# EAGLE design led_table_final_mass_done (EAGLE 7.6.0)
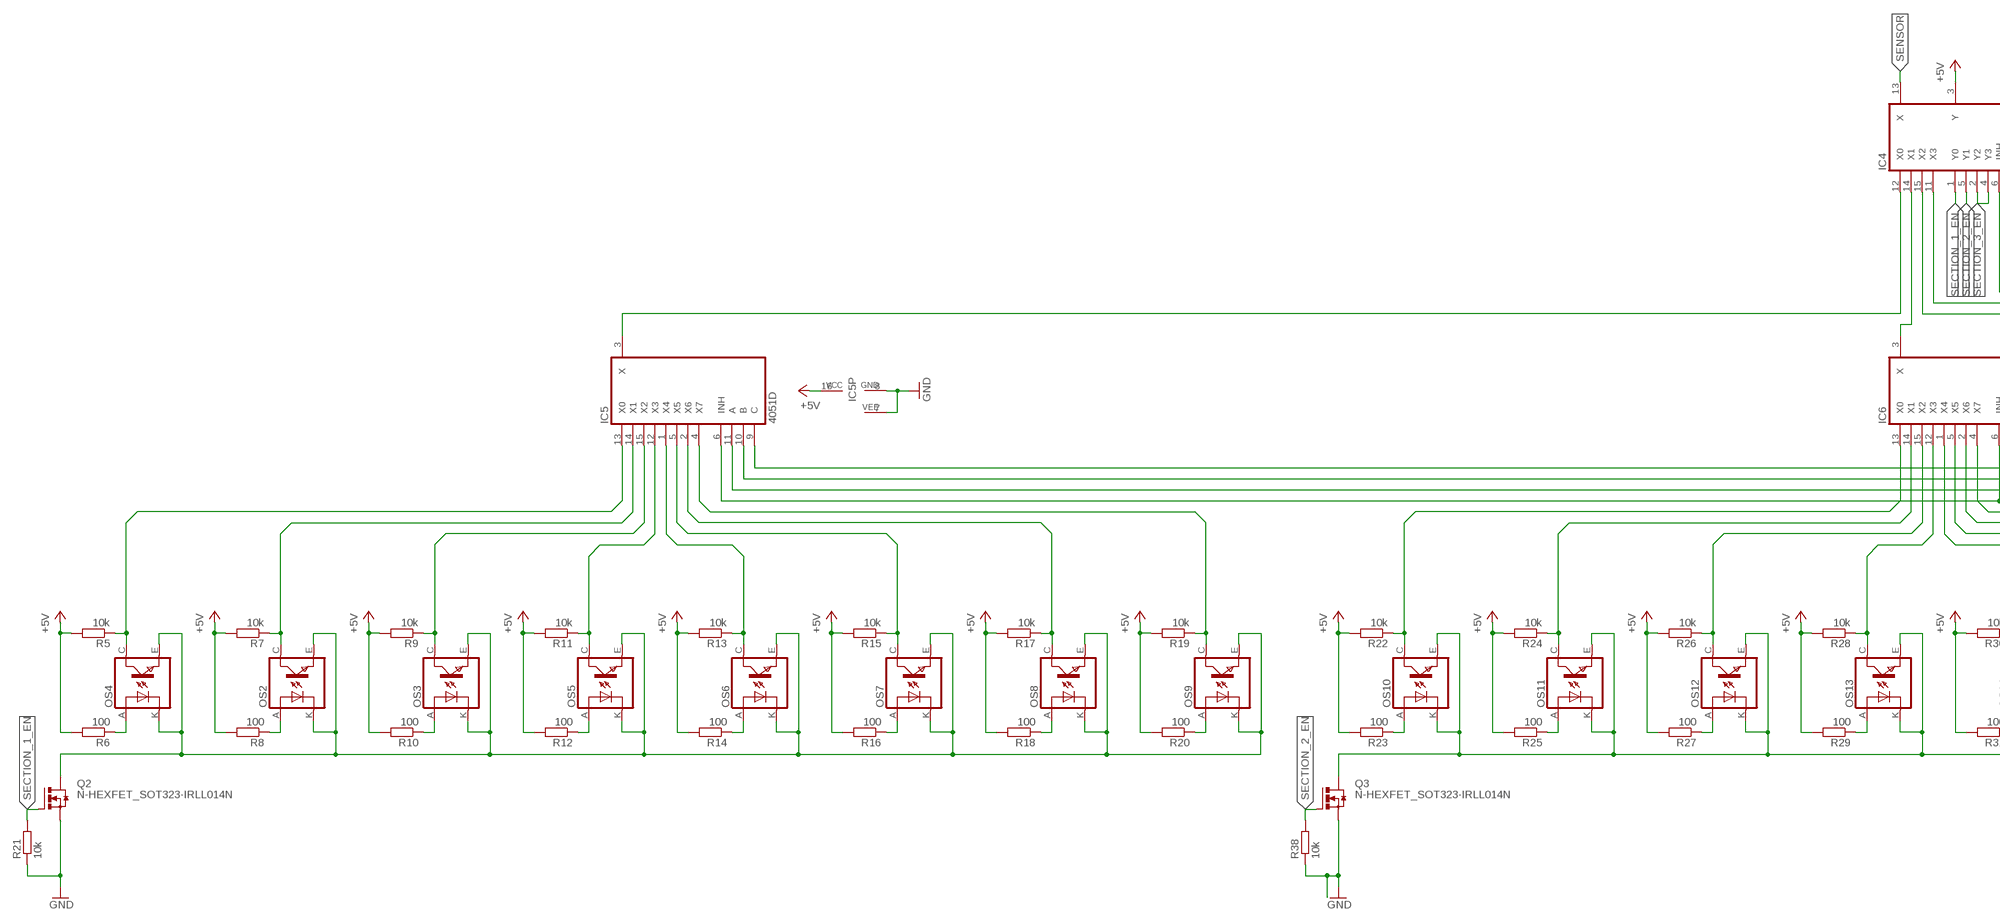
[diagram p0: schematic, sheet 1, part 1 of 2]
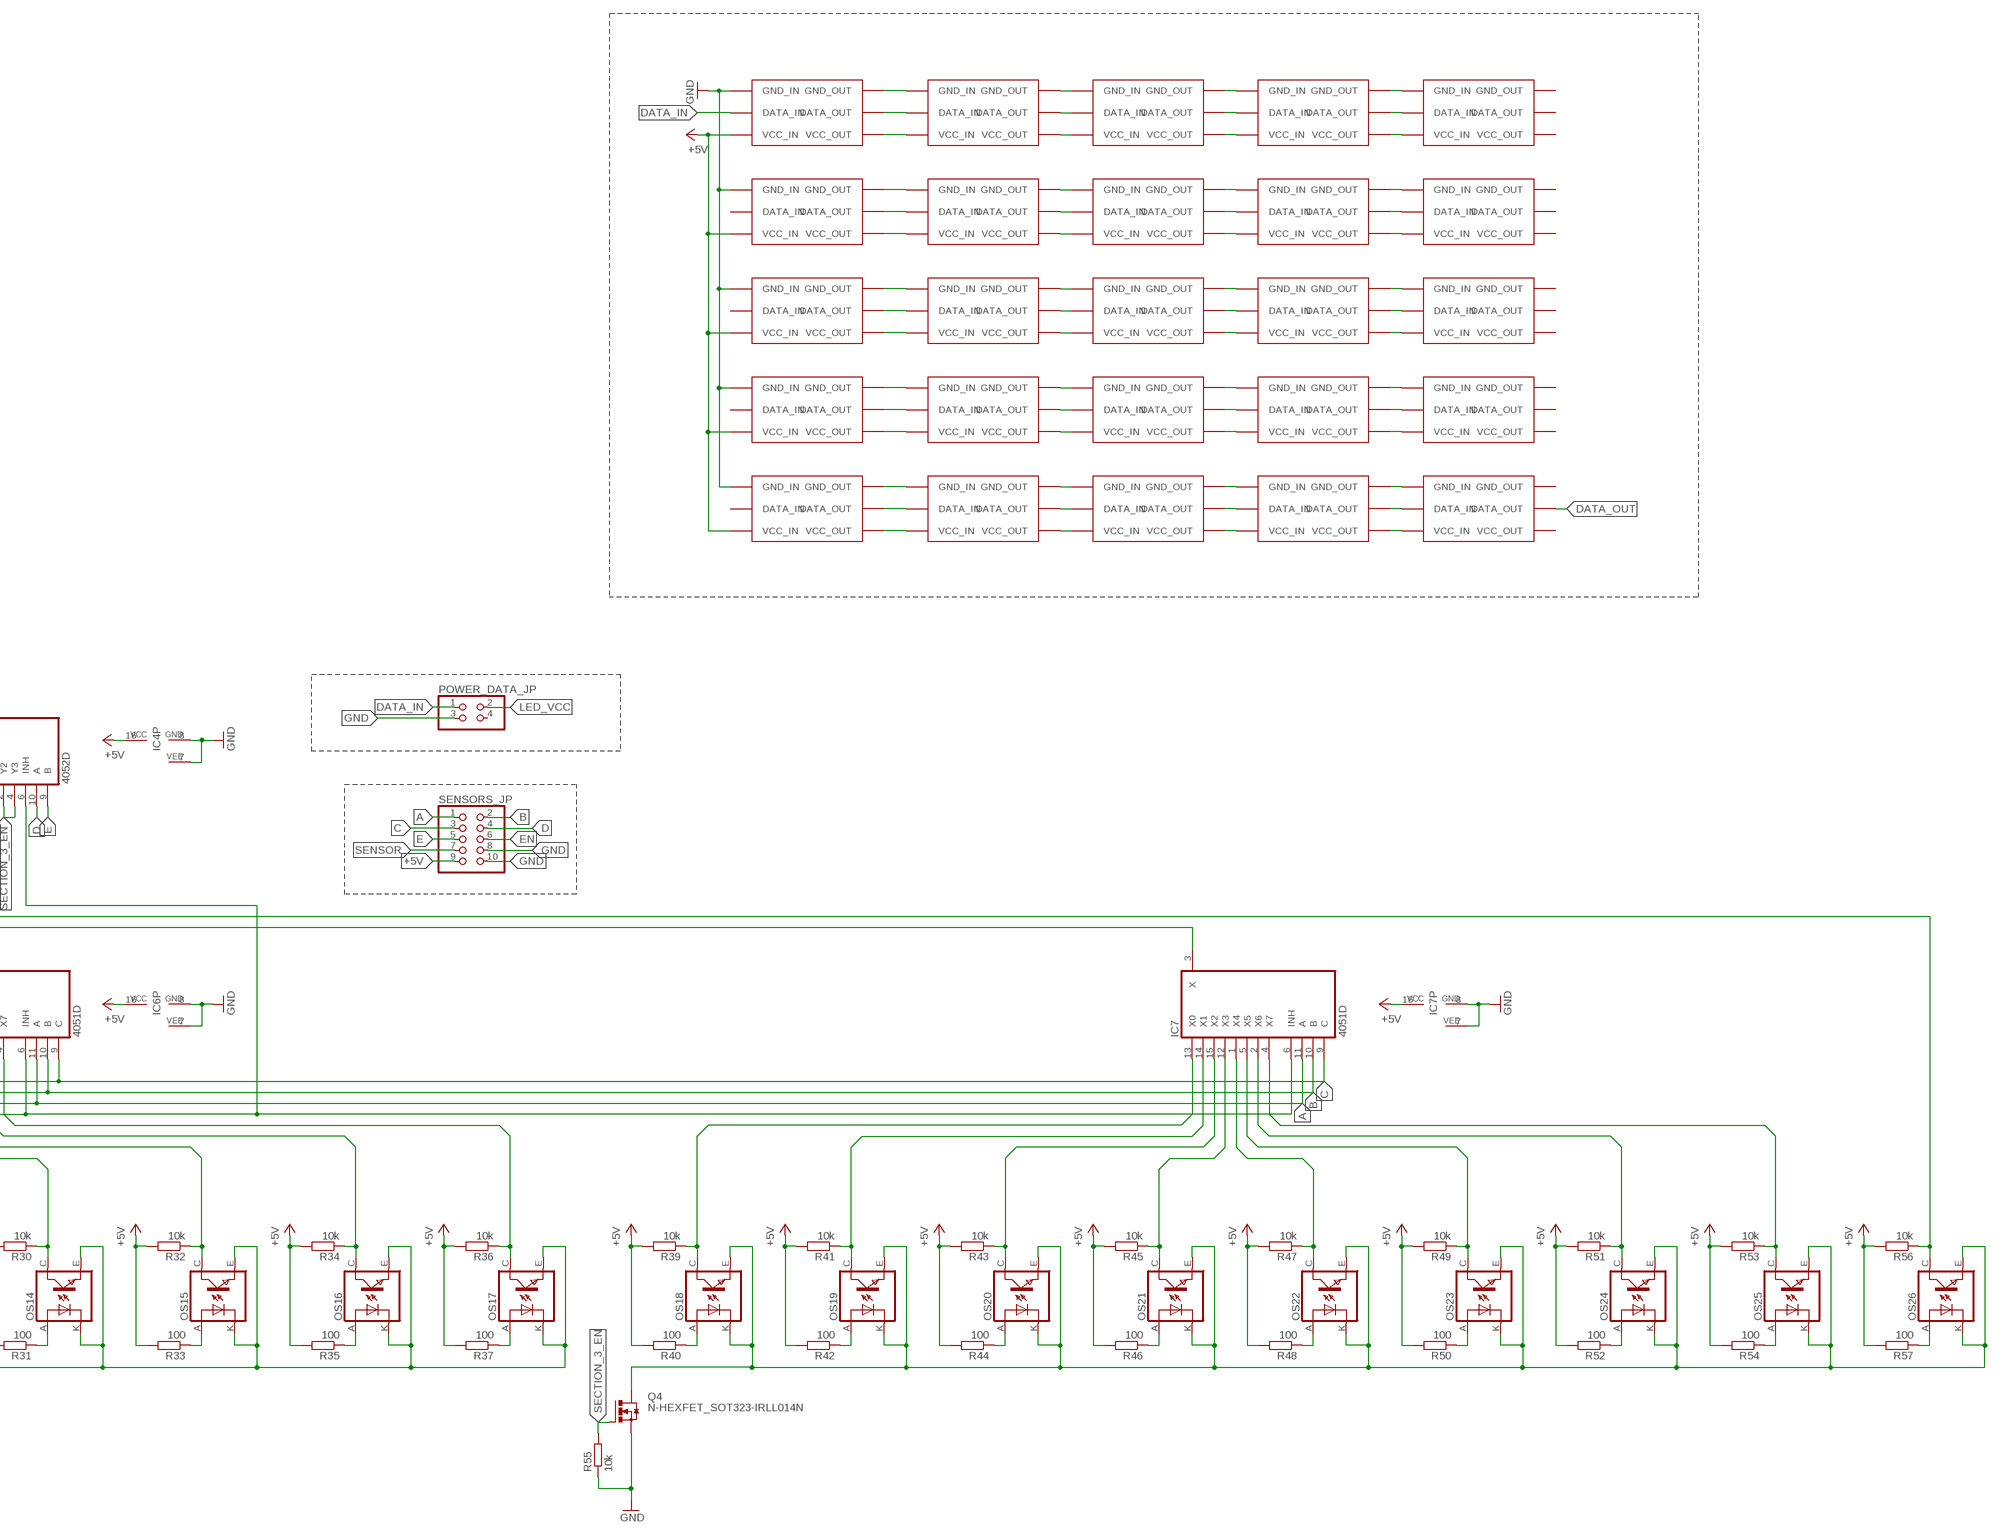
[diagram p1: schematic, sheet 1, part 2 of 2]

## Parts
IC4  4052D  [SO16]
IC5  4051D  [SO16]
IC6  4051D  [SO16]
IC7  4051D  [SO16]
OS2  TCRT5000  [TCRT5000]
OS3  TCRT5000  [TCRT5000]
OS4  TCRT5000  [TCRT5000]
OS5  TCRT5000  [TCRT5000]
OS6  TCRT5000  [TCRT5000]
OS7  TCRT5000  [TCRT5000]
OS8  TCRT5000  [TCRT5000]
OS9  TCRT5000  [TCRT5000]
OS10  TCRT5000  [TCRT5000]
OS11  TCRT5000  [TCRT5000]
OS12  TCRT5000  [TCRT5000]
OS13  TCRT5000  [TCRT5000]
OS14  TCRT5000  [TCRT5000]
OS15  TCRT5000  [TCRT5000]
OS16  TCRT5000  [TCRT5000]
OS17  TCRT5000  [TCRT5000]
OS18  TCRT5000  [TCRT5000]
OS19  TCRT5000  [TCRT5000]
OS20  TCRT5000  [TCRT5000]
OS21  TCRT5000  [TCRT5000]
OS22  TCRT5000  [TCRT5000]
OS23  TCRT5000  [TCRT5000]
OS24  TCRT5000  [TCRT5000]
OS25  TCRT5000  [TCRT5000]
OS26  TCRT5000  [TCRT5000]
POWER_DATA_JP  PINHD-2X2  [2X02]
Q2  N-HEXFET_SOT323-IRLL014N  [SOT223]
Q3  N-HEXFET_SOT323-IRLL014N  [SOT223]
Q4  N-HEXFET_SOT323-IRLL014N  [SOT223]
R5  10k  R-EU_R1206  [R1206]
R6  100  R-EU_R1206  [R1206]
R7  10k  R-EU_R1206  [R1206]
R8  100  R-EU_R1206  [R1206]
R9  10k  R-EU_R1206  [R1206]
R10  100  R-EU_R1206  [R1206]
R11  10k  R-EU_R1206  [R1206]
R12  100  R-EU_R1206  [R1206]
R13  10k  R-EU_R1206  [R1206]
R14  100  R-EU_R1206  [R1206]
R15  10k  R-EU_R1206  [R1206]
R16  100  R-EU_R1206  [R1206]
R17  10k  R-EU_R1206  [R1206]
R18  100  R-EU_R1206  [R1206]
R19  10k  R-EU_R1206  [R1206]
R20  100  R-EU_R1206  [R1206]
R21  10k  R-EU_R1206  [R1206]
R22  10k  R-EU_R1206  [R1206]
R23  100  R-EU_R1206  [R1206]
R24  10k  R-EU_R1206  [R1206]
R25  100  R-EU_R1206  [R1206]
R26  10k  R-EU_R1206  [R1206]
R27  100  R-EU_R1206  [R1206]
R28  10k  R-EU_R1206  [R1206]
R29  100  R-EU_R1206  [R1206]
R30  10k  R-EU_R1206  [R1206]
R31  100  R-EU_R1206  [R1206]
R32  10k  R-EU_R1206  [R1206]
R33  100  R-EU_R1206  [R1206]
R34  10k  R-EU_R1206  [R1206]
R35  100  R-EU_R1206  [R1206]
R36  10k  R-EU_R1206  [R1206]
R37  100  R-EU_R1206  [R1206]
R38  10k  R-EU_R1206  [R1206]
R39  10k  R-EU_R1206  [R1206]
R40  100  R-EU_R1206  [R1206]
R41  10k  R-EU_R1206  [R1206]
R42  100  R-EU_R1206  [R1206]
R43  10k  R-EU_R1206  [R1206]
R44  100  R-EU_R1206  [R1206]
R45  10k  R-EU_R1206  [R1206]
R46  100  R-EU_R1206  [R1206]
R47  10k  R-EU_R1206  [R1206]
R48  100  R-EU_R1206  [R1206]
R49  10k  R-EU_R1206  [R1206]
R50  100  R-EU_R1206  [R1206]
R51  10k  R-EU_R1206  [R1206]
R52  100  R-EU_R1206  [R1206]
R53  10k  R-EU_R1206  [R1206]
R54  100  R-EU_R1206  [R1206]
R55  10k  R-EU_R1206  [R1206]
R56  10k  R-EU_R1206  [R1206]
R57  100  R-EU_R1206  [R1206]
SENSORS_JP  PINHD-2X5  [2X05]
U$1  WS2812_ON_STRIP  [WS_PIN]
U$2  WS2812_ON_STRIP  [WS_PIN]
U$3  WS2812_ON_STRIP  [WS_PIN]
U$4  WS2812_ON_STRIP  [WS_PIN]
U$5  WS2812_ON_STRIP  [WS_PIN]
U$6  WS2812_ON_STRIP  [WS_PIN]
U$7  WS2812_ON_STRIP  [WS_PIN]
U$8  WS2812_ON_STRIP  [WS_PIN]
U$9  WS2812_ON_STRIP  [WS_PIN]
U$10  WS2812_ON_STRIP  [WS_PIN]
U$11  WS2812_ON_STRIP  [WS_PIN]
U$12  WS2812_ON_STRIP  [WS_PIN]
U$13  WS2812_ON_STRIP  [WS_PIN]
U$14  WS2812_ON_STRIP  [WS_PIN]
U$15  WS2812_ON_STRIP  [WS_PIN]
U$16  WS2812_ON_STRIP  [WS_PIN]
U$17  WS2812_ON_STRIP  [WS_PIN]
U$18  WS2812_ON_STRIP  [WS_PIN]
U$19  WS2812_ON_STRIP  [WS_PIN]
U$20  WS2812_ON_STRIP  [WS_PIN]
U$21  WS2812_ON_STRIP  [WS_PIN]
U$22  WS2812_ON_STRIP  [WS_PIN]
U$23  WS2812_ON_STRIP  [WS_PIN]
U$24  WS2812_ON_STRIP  [WS_PIN]
U$25  WS2812_ON_STRIP  [WS_PIN]

## Nets
+5V: IC4.3(Y) IC4.16(VCC) IC5.16(VCC) IC6.16(VCC) IC7.16(VCC) R5.2 R6.2 R7.2 R8.2 R9.2 R10.2 R11.2 R12.2 R13.2 R14.2 R15.2 R16.2 R17.2 R18.2 R19.2 R20.2 R22.2 R23.2 R24.2 R25.2 R26.2 R27.2 R28.2 R29.2 R30.2 R31.2 R32.2 R33.2 R34.2 R35.2 R36.2 R37.2 R39.2 R40.2 R41.2 R42.2 R43.2 R44.2 R45.2 R46.2 R47.2 R48.2 R49.2 R50.2 R51.2 R52.2 R53.2 R54.2 R56.2 R57.2 SENSORS_JP.9
A: IC5.11(A) IC6.11(A) IC7.11(A) SENSORS_JP.1
B: IC5.10(B) IC6.10(B) IC7.10(B) SENSORS_JP.2
C: IC5.9(C) IC6.9(C) IC7.9(C) SENSORS_JP.3
D: IC4.10(A) SENSORS_JP.4
DATA_IN: POWER_DATA_JP.1 U$16.DATA_IN
DATA_OUT: U$10.DATA_OUT
E: IC4.9(B) SENSORS_JP.5
EN: IC4.6(INH) IC5.6(INH) IC6.6(INH) IC7.6(INH) SENSORS_JP.6
GND: IC4.7(VEE) IC4.8(GND) IC5.7(VEE) IC5.8(GND) IC6.7(VEE) IC6.8(GND) IC7.7(VEE) IC7.8(GND) POWER_DATA_JP.3 Q2.3(S) Q3.3(S) Q4.3(S) R21.1 R38.1 R55.1 SENSORS_JP.8 SENSORS_JP.10 U$1.GND_IN U$6.GND_IN U$11.GND_IN U$16.GND_IN U$21.GND_IN
LED_VCC: POWER_DATA_JP.2 U$1.VCC_IN U$6.VCC_IN U$11.VCC_IN U$16.VCC_IN U$21.VCC_IN ; supply symbol labelled +5V
N$1: U$1.VCC_OUT U$2.VCC_IN
N$2: U$1.DATA_OUT U$2.DATA_IN
N$3: U$1.GND_OUT U$2.GND_IN
N$4: U$2.VCC_OUT U$3.VCC_IN
N$5: U$2.DATA_OUT U$3.DATA_IN
N$6: U$2.GND_OUT U$3.GND_IN
N$7: U$3.VCC_OUT U$4.VCC_IN
N$8: U$3.DATA_OUT U$4.DATA_IN
N$9: U$3.GND_OUT U$4.GND_IN
N$10: U$4.VCC_OUT U$5.VCC_IN
N$11: OS4.A(ANODE) R6.1
N$12: IC5.13(X0) OS4.C(COLLECTOR) R5.1
N$13: IC5.14(X1) OS2.C(COLLECTOR) R7.1
N$14: IC5.15(X2) OS3.C(COLLECTOR) R9.1
N$15: OS2.A(ANODE) R8.1
N$16: IC5.1(X4) OS6.C(COLLECTOR) R13.1
N$17: IC6.13(X0) OS10.C(COLLECTOR) R22.1
N$18: OS3.A(ANODE) R10.1
N$19: OS10.A(ANODE) R23.1
N$20: IC5.12(X3) OS5.C(COLLECTOR) R11.1
N$21: OS5.A(ANODE) R12.1
N$22: IC6.14(X1) OS11.C(COLLECTOR) R24.1
N$23: OS11.A(ANODE) R25.1
N$24: OS6.A(ANODE) R14.1
N$25: OS12.A(ANODE) R27.1
N$26: IC5.5(X5) OS7.C(COLLECTOR) R15.1
N$27: OS7.A(ANODE) R16.1
N$28: IC6.12(X3) OS13.C(COLLECTOR) R28.1
N$29: IC5.2(X6) OS8.C(COLLECTOR) R17.1
N$30: OS8.A(ANODE) R18.1
N$31: OS2.E(EMITTER) OS2.K(CATHODE) OS3.E(EMITTER) OS3.K(CATHODE) OS4.E(EMITTER) OS4.K(CATHODE) OS5.E(EMITTER) OS5.K(CATHODE) OS6.E(EMITTER) OS6.K(CATHODE) OS7.E(EMITTER) OS7.K(CATHODE) OS8.E(EMITTER) OS8.K(CATHODE) OS9.E(EMITTER) OS9.K(CATHODE) Q2.4(D)
N$32: IC5.4(X7) OS9.C(COLLECTOR) R19.1
N$33: OS9.A(ANODE) R20.1
N$34: OS13.A(ANODE) R29.1
N$35: U$4.DATA_OUT U$5.DATA_IN
N$36: OS14.A(ANODE) R31.1
N$37: IC6.5(X5) OS15.C(COLLECTOR) R32.1
N$38: OS15.A(ANODE) R33.1
N$39: IC6.2(X6) OS16.C(COLLECTOR) R34.1
N$40: OS16.A(ANODE) R35.1
N$41: OS10.E(EMITTER) OS10.K(CATHODE) OS11.E(EMITTER) OS11.K(CATHODE) OS12.E(EMITTER) OS12.K(CATHODE) OS13.E(EMITTER) OS13.K(CATHODE) OS14.E(EMITTER) OS14.K(CATHODE) OS15.E(EMITTER) OS15.K(CATHODE) OS16.E(EMITTER) OS16.K(CATHODE) OS17.E(EMITTER) OS17.K(CATHODE) Q3.4(D)
N$42: IC6.4(X7) OS17.C(COLLECTOR) R36.1
N$43: OS17.A(ANODE) R37.1
N$44: U$4.GND_OUT U$5.GND_IN
N$45: IC6.15(X2) OS12.C(COLLECTOR) R26.1
N$46: IC6.1(X4) OS14.C(COLLECTOR) R30.1
N$47: IC7.13(X0) OS18.C(COLLECTOR) R39.1
N$48: OS18.A(ANODE) R40.1
N$49: IC7.14(X1) OS19.C(COLLECTOR) R41.1
N$50: OS19.A(ANODE) R42.1
N$51: OS20.A(ANODE) R44.1
N$52: IC7.12(X3) OS21.C(COLLECTOR) R45.1
N$53: OS21.A(ANODE) R46.1
N$54: OS22.A(ANODE) R48.1
N$55: IC7.5(X5) OS23.C(COLLECTOR) R49.1
N$56: OS23.A(ANODE) R50.1
N$57: IC7.2(X6) OS24.C(COLLECTOR) R51.1
N$58: OS24.A(ANODE) R52.1
N$59: U$6.VCC_OUT U$7.VCC_IN
N$60: IC7.4(X7) OS25.C(COLLECTOR) R53.1
N$61: OS25.A(ANODE) R54.1
N$62: U$6.DATA_OUT U$7.DATA_IN
N$63: IC7.15(X2) OS20.C(COLLECTOR) R43.1
N$64: IC7.1(X4) OS22.C(COLLECTOR) R47.1
N$65: U$6.GND_OUT U$7.GND_IN
N$66: U$7.VCC_OUT U$8.VCC_IN
N$67: U$7.DATA_OUT U$8.DATA_IN
N$68: U$7.GND_OUT U$8.GND_IN
N$69: IC4.12(X0) IC5.3(X)
N$70: IC4.14(X1) IC6.3(X)
N$71: IC4.15(X2) IC7.3(X)
N$72: IC4.11(X3) OS26.C(COLLECTOR) R56.1
N$73: OS18.E(EMITTER) OS18.K(CATHODE) OS19.E(EMITTER) OS19.K(CATHODE) OS20.E(EMITTER) OS20.K(CATHODE) OS21.E(EMITTER) OS21.K(CATHODE) OS22.E(EMITTER) OS22.K(CATHODE) OS23.E(EMITTER) OS23.K(CATHODE) OS24.E(EMITTER) OS24.K(CATHODE) OS25.E(EMITTER) OS25.K(CATHODE) OS26.E(EMITTER) OS26.K(CATHODE) Q4.4(D)
N$74: U$8.VCC_OUT U$9.VCC_IN
N$75: OS26.A(ANODE) R57.1
N$76: U$8.DATA_OUT U$9.DATA_IN
N$77: U$8.GND_OUT U$9.GND_IN
N$78: U$9.VCC_OUT U$10.VCC_IN
N$79: U$9.DATA_OUT U$10.DATA_IN
N$80: U$9.GND_OUT U$10.GND_IN
N$81: U$11.VCC_OUT U$12.VCC_IN
N$82: U$11.DATA_OUT U$12.DATA_IN
N$83: U$11.GND_OUT U$12.GND_IN
N$84: U$12.VCC_OUT U$13.VCC_IN
N$85: U$12.DATA_OUT U$13.DATA_IN
N$86: U$12.GND_OUT U$13.GND_IN
N$87: U$13.VCC_OUT U$14.VCC_IN
N$88: U$13.DATA_OUT U$14.DATA_IN
N$89: U$13.GND_OUT U$14.GND_IN
N$90: U$14.VCC_OUT U$15.VCC_IN
N$91: U$14.DATA_OUT U$15.DATA_IN
N$92: U$14.GND_OUT U$15.GND_IN
N$93: U$16.VCC_OUT U$17.VCC_IN
N$94: U$16.DATA_OUT U$17.DATA_IN
N$95: U$16.GND_OUT U$17.GND_IN
N$96: U$17.VCC_OUT U$18.VCC_IN
N$97: U$17.DATA_OUT U$18.DATA_IN
N$98: U$17.GND_OUT U$18.GND_IN
N$99: U$18.VCC_OUT U$19.VCC_IN
N$100: U$18.DATA_OUT U$19.DATA_IN
N$101: U$18.GND_OUT U$19.GND_IN
N$102: U$19.VCC_OUT U$20.VCC_IN
N$103: U$19.DATA_OUT U$20.DATA_IN
N$104: U$19.GND_OUT U$20.GND_IN
N$105: U$21.VCC_OUT U$22.VCC_IN
N$106: U$21.DATA_OUT U$22.DATA_IN
N$107: U$21.GND_OUT U$22.GND_IN
N$108: U$22.VCC_OUT U$23.VCC_IN
N$109: U$22.DATA_OUT U$23.DATA_IN
N$110: U$22.GND_OUT U$23.GND_IN
N$111: U$23.VCC_OUT U$24.VCC_IN
N$112: U$23.DATA_OUT U$24.DATA_IN
N$113: U$23.GND_OUT U$24.GND_IN
N$114: U$24.VCC_OUT U$25.VCC_IN
N$115: U$24.DATA_OUT U$25.DATA_IN
N$116: U$24.GND_OUT U$25.GND_IN
SECTION_1_EN: IC4.1(Y0) Q2.1(G) R21.2
SECTION_2_EN: IC4.5(Y1) Q3.1(G) R38.2
SECTION_3_EN: IC4.2(Y2) IC4.4(Y3) Q4.1(G) R55.2
SENSOR: IC4.13(X) SENSORS_JP.7
Unconnected: POWER_DATA_JP.4 U$1.DATA_IN U$5.DATA_OUT U$6.DATA_IN U$11.DATA_IN U$15.DATA_OUT U$20.DATA_OUT U$21.DATA_IN U$25.DATA_OUT

## Power pins joined to a net without a drawn wire
GND_OUT: U$5.GND_OUT U$10.GND_OUT U$15.GND_OUT U$20.GND_OUT U$25.GND_OUT
VCC_OUT: U$5.VCC_OUT U$10.VCC_OUT U$15.VCC_OUT U$20.VCC_OUT U$25.VCC_OUT

## Library data of the parts
IC4 = 40xx:4052: Dual 4-channel ANALOG MULTIPLEXER
IC5-IC7 = 40xx:4051: 8-channel ANALOG MULTIPLEXER
OS2-OS26 = tcrt5000:TCRT5000
POWER_DATA_JP = pinhead:PINHD-2X2: PIN HEADER
Q2-Q4 = transistor-power:N-HEXFET_?-*: HEXFET® Power MOSFET
R5-R57 = rcl:R-EU_: RESISTOR, European symbol
SENSORS_JP = pinhead:PINHD-2X5: PIN HEADER
U$1-U$25 = ws2812_on_strip:WS2812_ON_STRIP

## Board
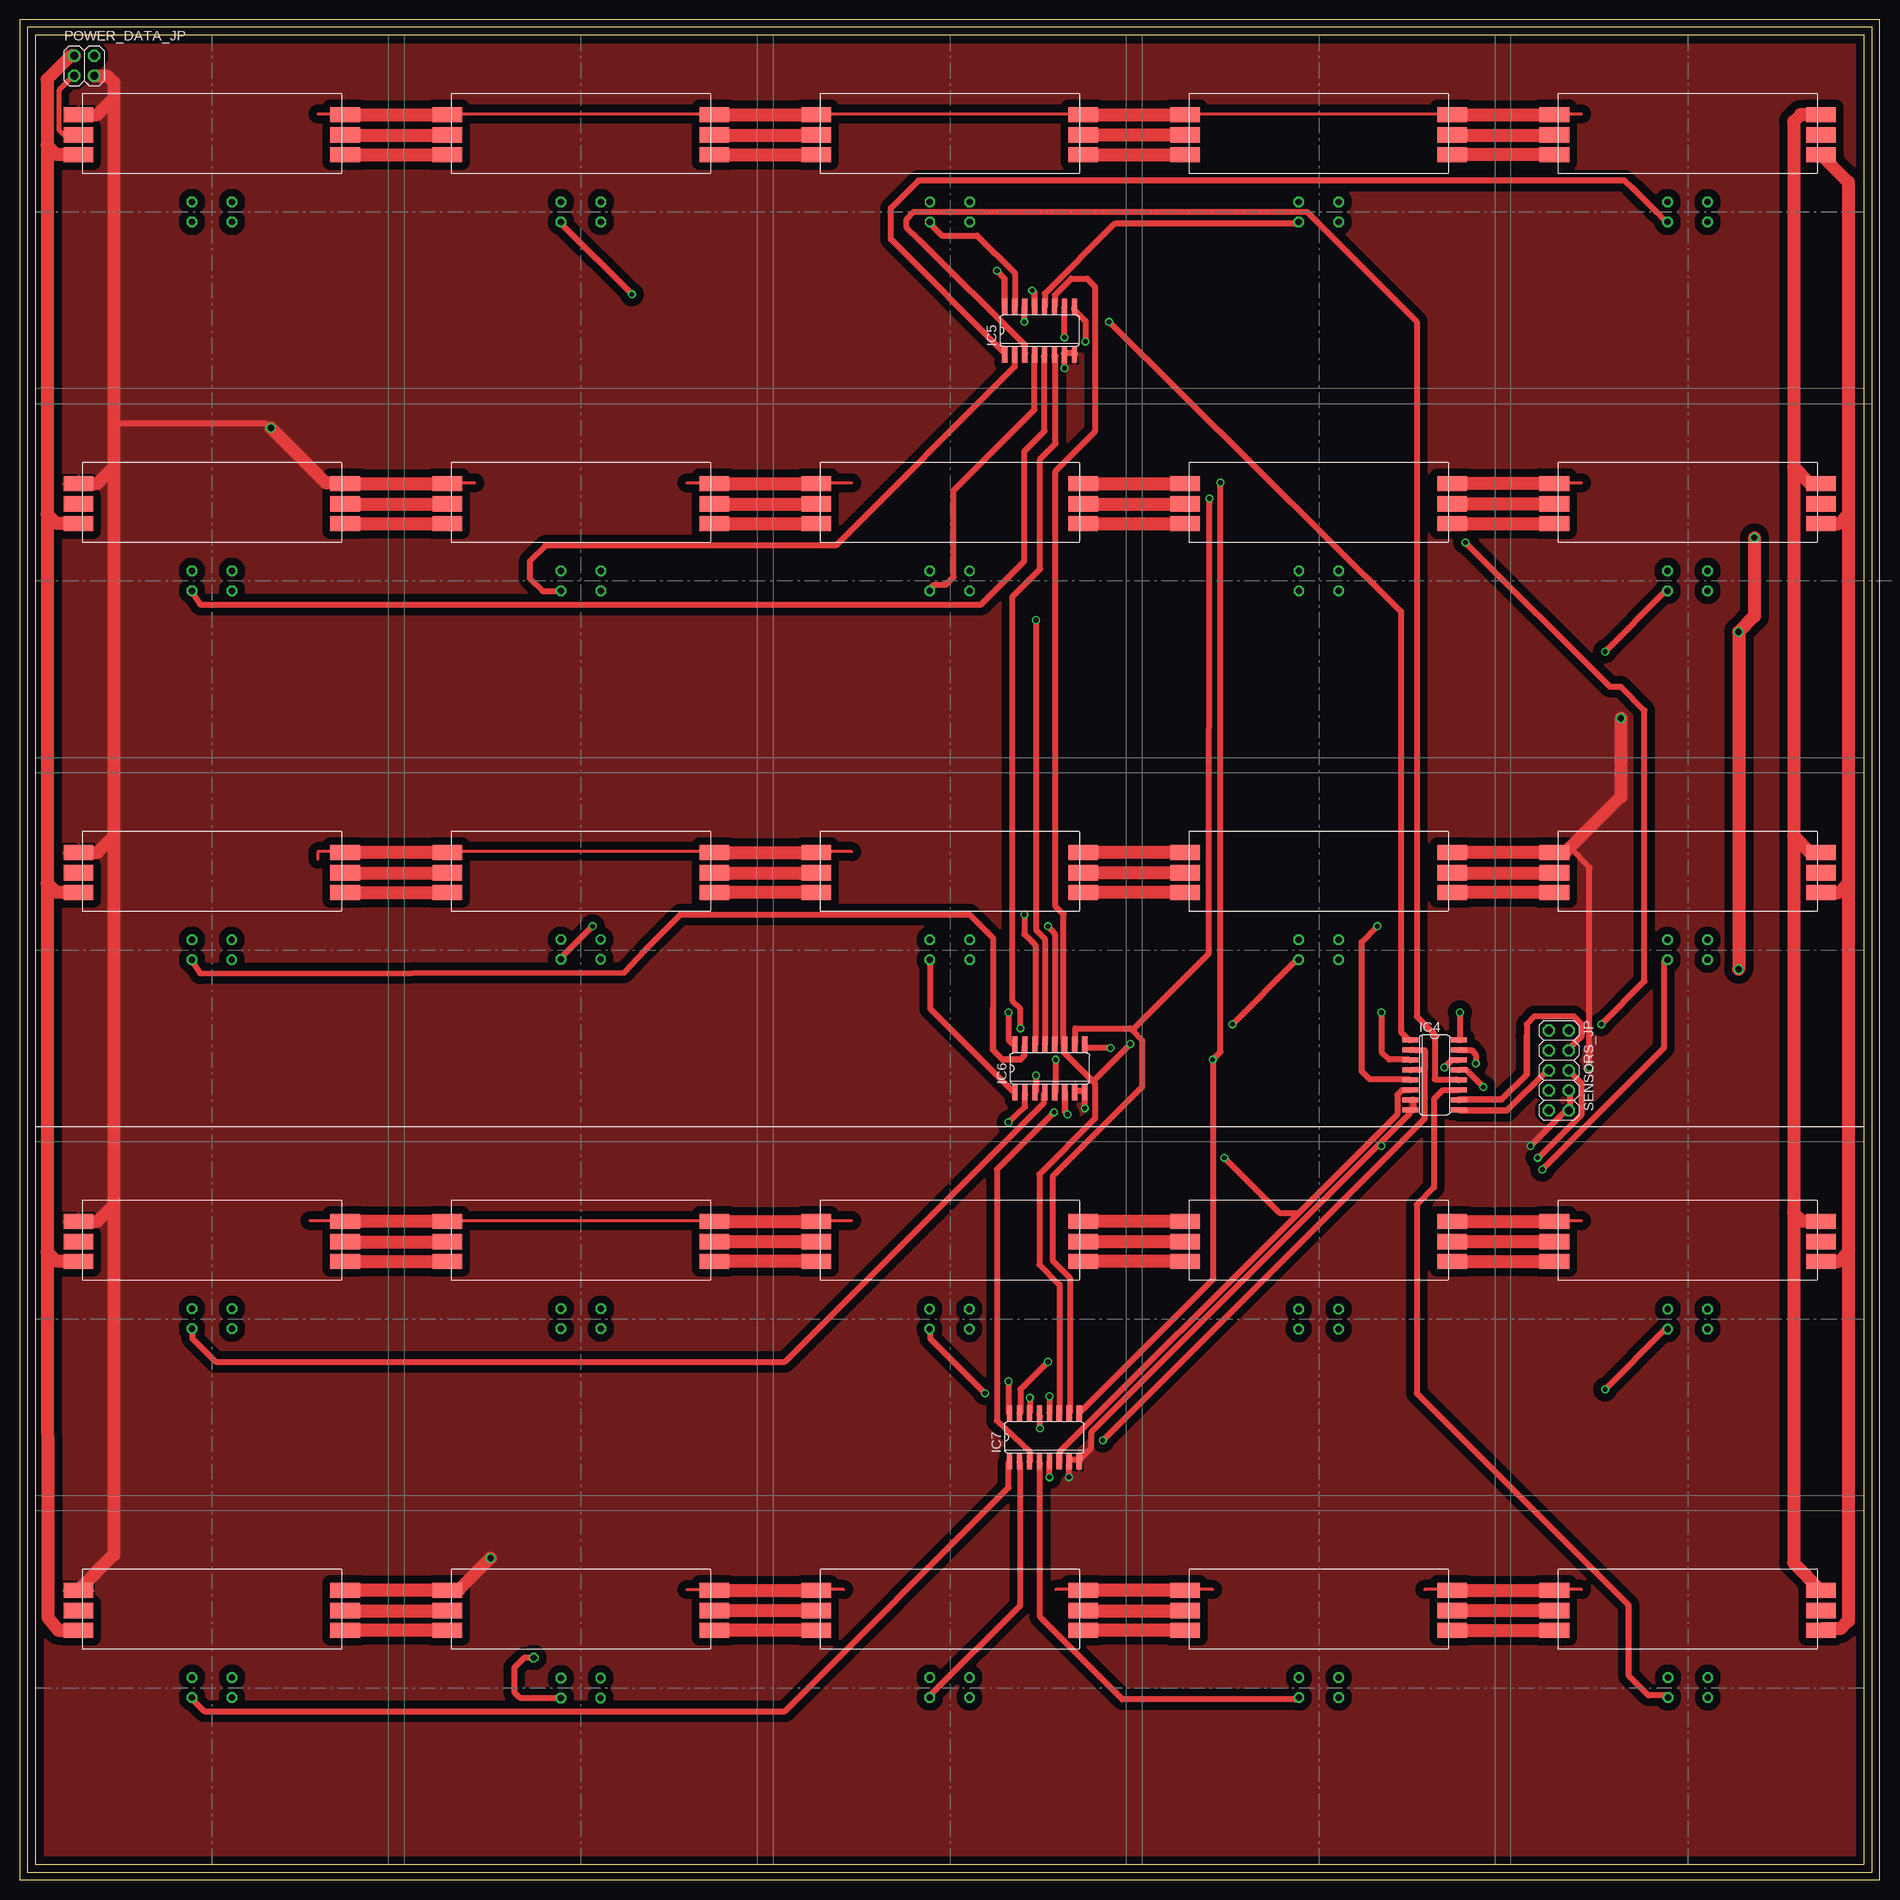
[diagram p2: board, top side]
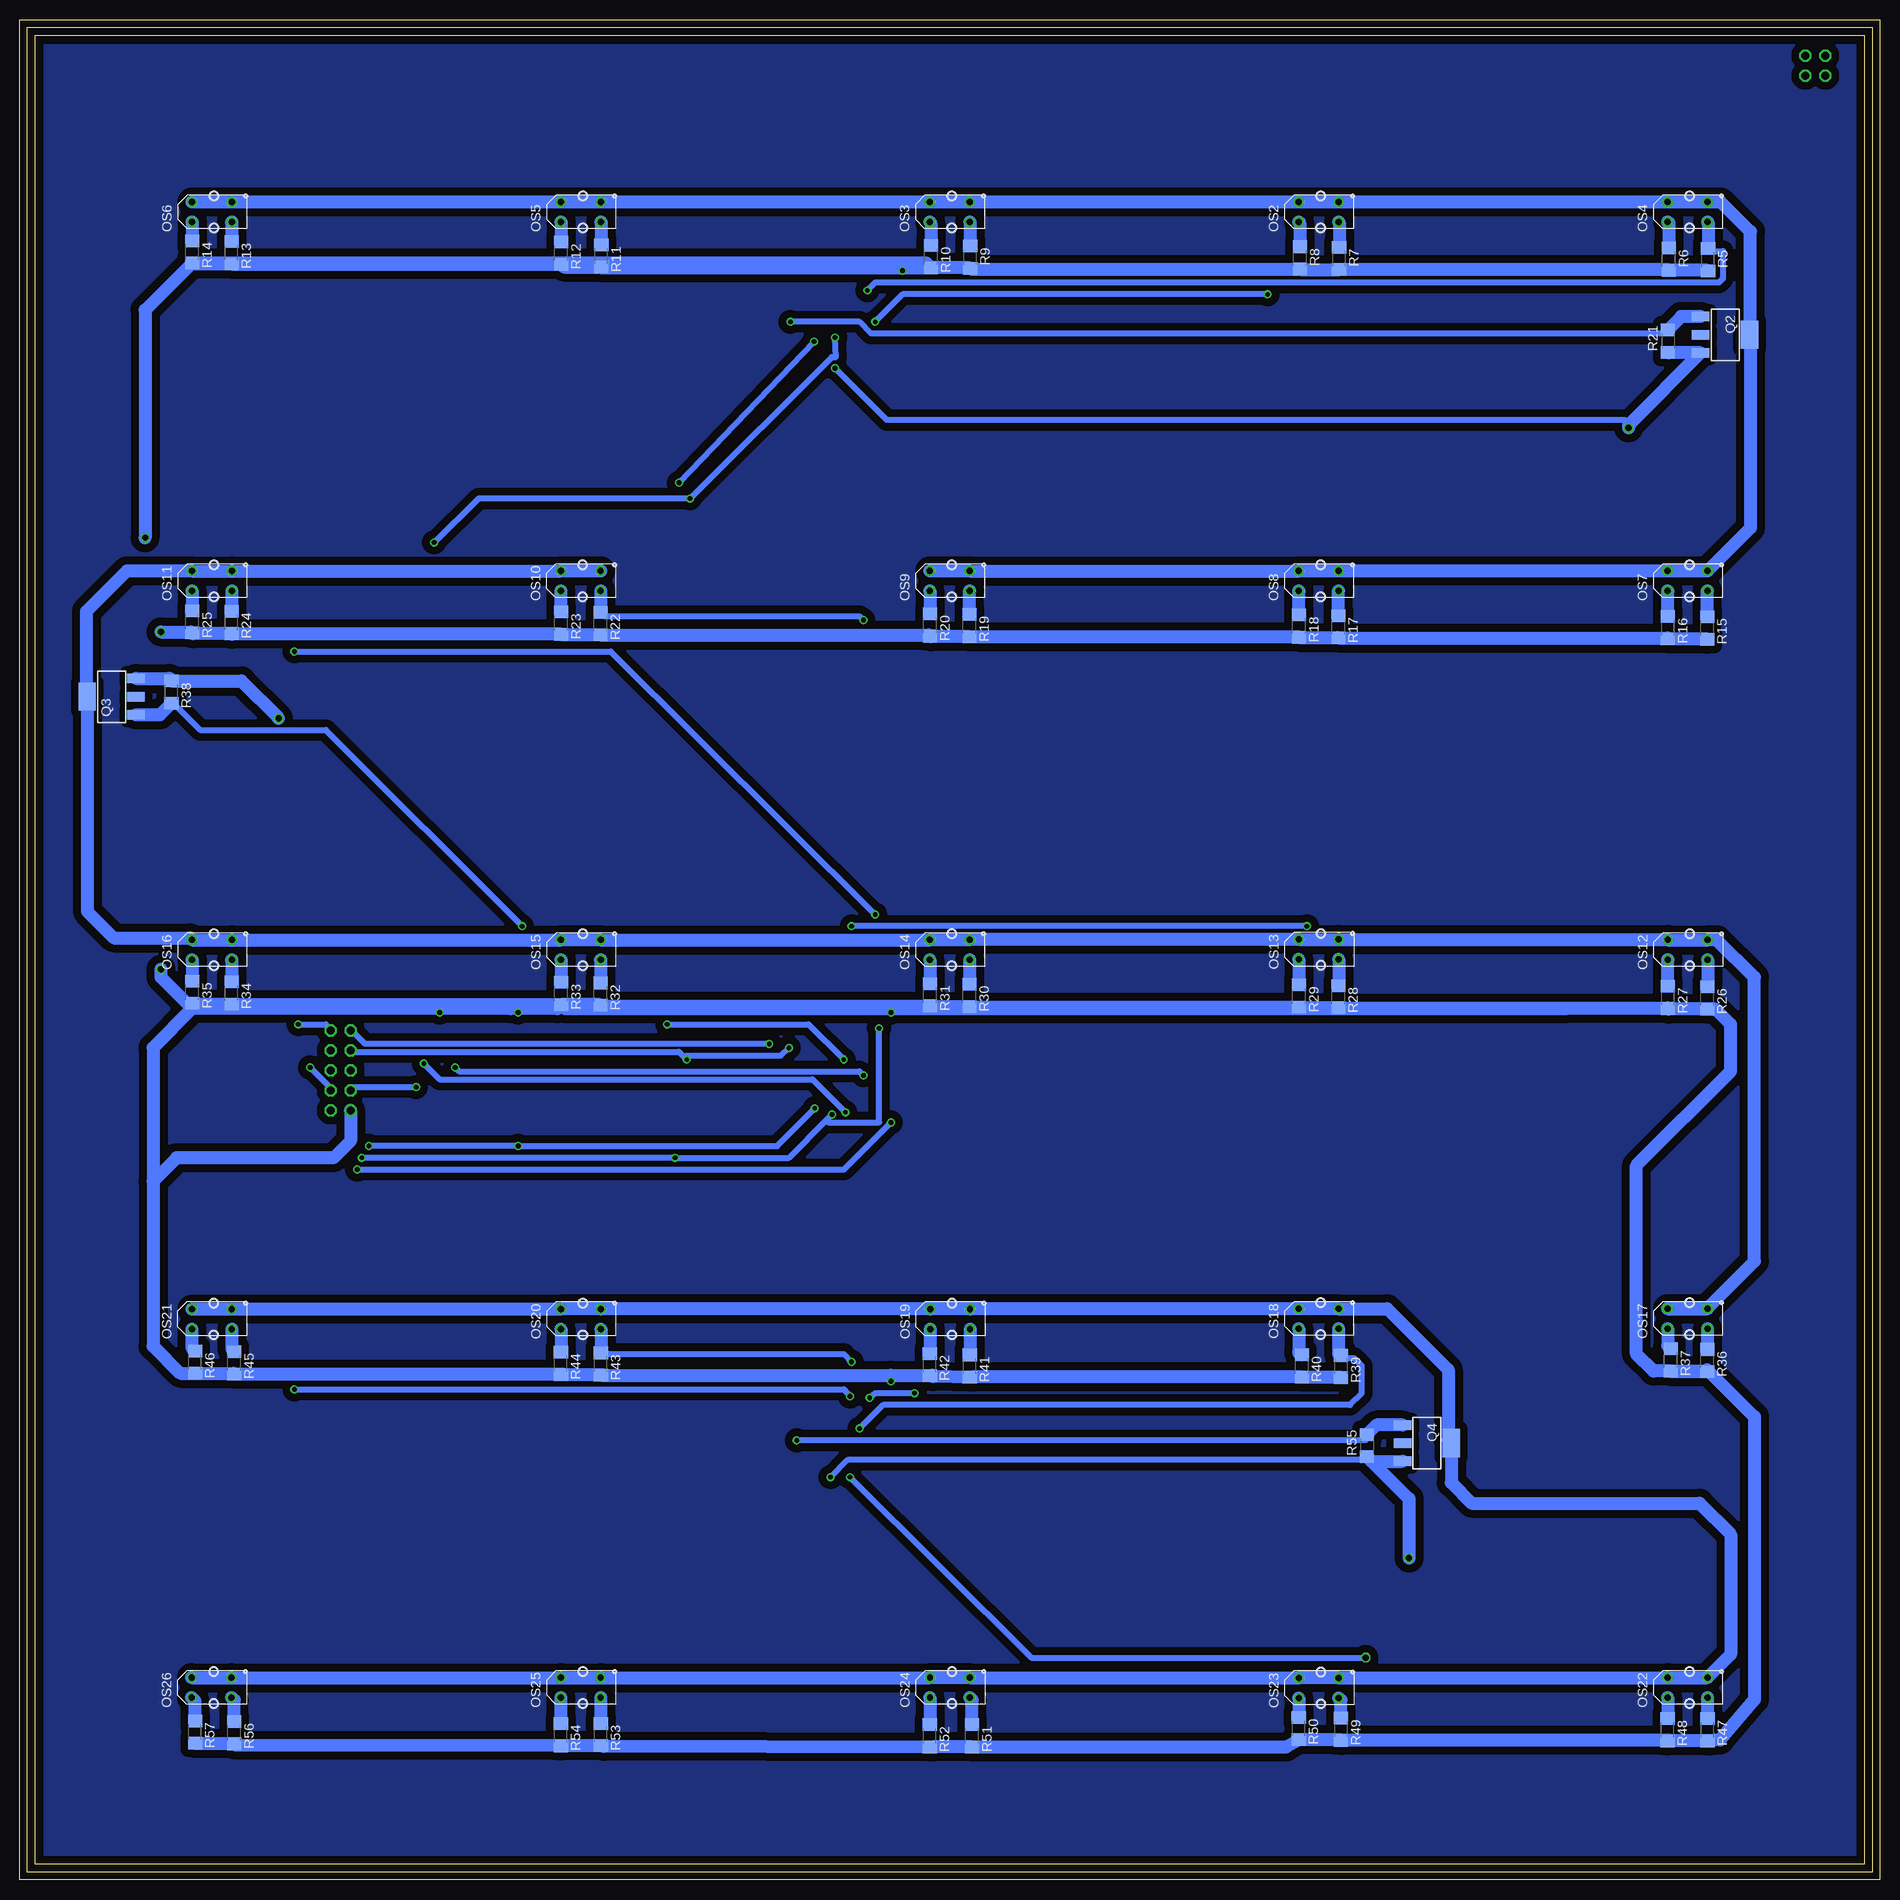
[diagram p3: board, bottom side, seen from below]

Size 237 x 237 mm. Coordinates in mm from the lower left corner, seen from the top.
Outline: 235,235 2,235 2,2 235,2 235,235
Outline: 1,236 1,1 236,1 236,236 1,236
Outline: 0,237 0,0 237,0 237,237 0,237
Copper layers (1*16): Top 0.035mm / dielectric 1.5mm / Bottom 0.035mm
Design rules "default *": minimum track width 30mil, minimum drill 24mil, track to track 8mil, track to pad 8mil, pad to pad 8mil, via to via 8mil, smd to smd 8mil, copper to edge 40mil, drill to drill 8mil, minimum pad ring 10mil, minimum via ring 8mil, stop-mask expansion 4mil, vias tented up to drill 0mil, thermal gap 10mil

### Footprints (pad centres in the part's own frame; a part is rotated, then mirrored left to right if it is on the bottom)
SO16 = smd 0.66 x 2.032: 1 -4.445,-3.073; 2 -3.175,-3.073; 3 -1.905,-3.073; 4 -0.635,-3.073; 5 0.635,-3.073; 6 1.905,-3.073; 7 3.175,-3.073; 8 4.445,-3.073; 9 4.445,3.073; 10 3.175,3.073; 11 1.905,3.073; 12 0.635,3.073; 13 -0.635,3.073; 14 -1.905,3.073; 15 -3.175,3.073; 16 -4.445,3.073
TCRT5000 = drill 0.8 octagon: A -2.54,-1.27; C 2.54,-1.27; E 2.54,1.27; K -2.54,1.27
2X02 = drill 1.016 octagon: 1 -1.27,-1.27; 2 -1.27,1.27; 3 1.27,-1.27; 4 1.27,1.27
SOT223 = smd 1.219 x 2.235: 1 -2.311,-3.099; 2 0,-3.099; 3 2.311,-3.099 | smd 3.6 x 2.2: 4 0,3.099
R1206 = smd 1.6 x 1.803: 1 -1.422,0; 2 1.422,0
2X05 = drill 1.016 octagon: 1 -5.08,-1.27; 2 -5.08,1.27; 3 -2.54,-1.27; 4 -2.54,1.27; 5 0,-1.27; 6 0,1.27; 7 2.54,-1.27; 8 2.54,1.27; 9 5.08,-1.27; 10 5.08,1.27
WS_PIN = smd 1.93 x 3.81: DATA_IN 0.2,-17; DATA_OUT 0.2,17; GND_IN -2.4,-17; GND_OUT -2.4,17; VCC_IN 2.7,-17; VCC_OUT 2.7,17

### Placement (x,y rotation side)
IC4  180.28,102.54 270 top
IC5  129.95,197.38 0 top
IC6  131.25,103.38 0 top
IC7  130.55,56.38 0 top
OS2  71.5,212.5 0 bottom
OS3  118.51,212.5 0 bottom
OS4  24.5,212.5 0 bottom
OS5  165.5,212.5 0 bottom
OS6  212.5,212.5 0 bottom
OS7  24.5,165.5 0 bottom
OS8  71.5,165.5 0 bottom
OS9  118.49,165.5 0 bottom
OS10  165.52,165.5 0 bottom
OS11  212.5,165.5 0 bottom
OS12  24.48,118.5 0 bottom
OS13  71.48,118.55 0 bottom
OS14  118.5,118.5 0 bottom
OS15  165.5,118.5 0 bottom
OS16  212.5,118.5 0 bottom
OS17  24.5,71.5 0 bottom
OS18  71.5,71.5 0 bottom
OS19  118.46,71.45 0 bottom
OS20  165.49,71.45 0 bottom
OS21  212.52,71.45 0 bottom
OS22  24.5,24.5 0 bottom
OS23  71.48,24.45 0 bottom
OS24  118.48,24.5 0 bottom
OS25  165.51,24.5 0 bottom
OS26  212.54,24.5 0 bottom
POWER_DATA_JP  8.23,231.11 0 top
Q2  19.72,196.85 270 bottom
Q3  225.28,150.75 90 bottom
Q4  57.72,55.65 270 bottom
R5  21.89,206.41 270 bottom
R6  26.89,206.49 270 bottom
R7  68.89,206.57 270 bottom
R8  73.89,206.65 270 bottom
R9  115.89,206.73 270 bottom
R10  120.89,206.81 270 bottom
R11  162.89,206.89 270 bottom
R12  168,207.24 270 bottom
R13  210,207.32 270 bottom
R14  215,207.4 270 bottom
R15  22,159.48 270 bottom
R16  27,159.56 270 bottom
R17  69,159.64 270 bottom
R18  74,159.72 270 bottom
R19  116,159.8 270 bottom
R20  121,159.88 270 bottom
R21  27,196.04 90 bottom
R22  163,160.04 270 bottom
R23  168,160.12 270 bottom
R24  210,160.2 270 bottom
R25  215,160.28 270 bottom
R26  22,112.36 270 bottom
R27  27,112.44 270 bottom
R28  69,112.52 270 bottom
R29  74,112.6 270 bottom
R30  116,112.68 270 bottom
R31  121,112.76 270 bottom
R32  163,112.84 270 bottom
R33  168,112.92 270 bottom
R34  210,113 270 bottom
R35  215,113.08 270 bottom
R36  22,66.16 270 bottom
R37  26.65,66.24 270 bottom
R38  217.65,151.32 270 bottom
R39  68.65,65.4 270 bottom
R40  73.65,65.48 270 bottom
R41  115.95,65.46 270 bottom
R42  121.05,65.64 270 bottom
R43  162.95,65.72 270 bottom
R44  168.05,65.8 270 bottom
R45  209.65,65.88 270 bottom
R46  214.65,65.96 270 bottom
R47  21.95,19.14 270 bottom
R48  27.05,19.12 270 bottom
R49  68.65,19.2 270 bottom
R50  74.05,19.28 270 bottom
R51  115.65,18.36 270 bottom
R52  121.05,18.34 270 bottom
R53  162.95,18.52 270 bottom
R54  168.05,18.5 270 bottom
R55  65.35,55.32 90 bottom
R56  209.65,18.76 270 bottom
R57  214.65,18.84 270 bottom
SENSORS_JP  196.11,103.13 270 top
U$1  24.5,81.5 270 top
U$2  71.5,81.5 270 top
U$3  118.5,81.5 270 top
U$4  165.5,81.5 270 top
U$5  212.5,81.5 270 top
U$6  24.5,34.5 270 top
U$7  71.5,34.5 270 top
U$8  118.5,34.5 270 top
U$9  165.5,34.5 270 top
U$10  212.5,34.5 270 top
U$11  24.5,128.5 270 top
U$12  71.5,128.5 270 top
U$13  118.5,128.5 270 top
U$14  165.5,128.5 270 top
U$15  212.5,128.5 270 top
U$16  24.5,222.5 270 top
U$17  71.5,222.5 270 top
U$18  118.5,222.5 270 top
U$19  165.5,222.5 270 top
U$20  212.5,222.5 270 top
U$21  24.5,175.5 270 top
U$22  71.5,175.5 270 top
U$23  118.5,175.5 270 top
U$24  165.5,175.5 270 top
U$25  212.5,175.5 270 top

### Tracks (layer width: path | path; a pad name or v marks a point on that pad's centre or on a via)
+5V  (via drill 0.61, 0.8)
  Top 0.762: v126,63.5 126,59.5 IC7.16 | v173.5,110.5 173.5,105.5 174.5,104.5 177,104.5 IC4.3 | v126,110.5 126,107 126.5,106.5 IC6.16 | v183.5,110.5 183.5,107 IC4.16 | 125.5,200.5 IC5.16
  Top 0.813: 125.5,200.5 125.5,204 v124.5,205
  Top 1.676: v221,171 221,161 v219,159 v219,116
  Bottom 0.762: v126,63.5 126,64.3 | v173.5,110.5 174.5,111 | v126,110.5 126,111 | v183.5,110.5 183.5,111 | v124.5,205 124.5,205.39
  Bottom 1.676: R13.2 214.92,205.9 R14.2 214.98,206 210,206 209.82,205.82 R12.2 167.65,205.47 R11.2 162.81,205.39 124.5,205.39 R10.2 | R10.2 115.97,205.39 R9.2 115.81,205.23 R8.2 73.81,205.15 R7.2 26.97,205.15 R6.2 21.97,205.07 R5.2 | R15.2 22.08,158.14 R16.2 27.08,158.22 R17.2 69.08,158.3 R18.2 74.08,158.38 R19.2 120.92,158.38 R20.2 121.16,158.62 R22.2 167.92,158.62 R23.2 209.92,158.7 R24.2 214.92,158.78 R25.2 215.14,159 v219,159 | R39.2 68.73,64.06 R40.2 115.57,64.06 R41.2 120.57,64.14 R42.2 120.73,64.3 126,64.3 R43.2 162.73,64.38 R44.2 167.73,64.46 R45.2 209.73,64.54 R46.2 216.54,64.54 220,68 220,89 | R36.2 26.57,64.74 R37.2 | R37.2 22.18,64.82 22,65 16,59 16,23 20.38,17.82 R47.2 21.73,17.7 R48.2 26.73,17.78 R49.2 68.73,17.86 R50.2 75.67,16.94 R51.2 120.57,16.94 R52.2 162.57,17.02 R53.2 167.57,17.1 R54.2 209.49,17.18 R56.2 214.57,17.34 R57.2 | R35.2 214.92,111.58 R34.2 209.92,111.5 R33.2 | R32.2 163.08,111.5 R33.2 | 163,111 167.5,111 R33.2 | 163,111 162.66,111.34 R31.2 120.92,111.26 R30.2 115.92,111.18 R29.2 73.92,111.1 R28.2 27.08,111.1 R27.2 26.92,110.94 R26.2 20.94,110.94 19,109 19,103 31,91 31,67 28.82,64.82 R37.2 | 163,111 126,111 40,111 | R33.2 168.5,111 174.5,111 183.5,111 215,111 | 215,111 220,106 220,89 | R10.2 121.5,206 215,206 221,200 v221,171 | v219,116 219,115 215,111 | SENSORS_JP.9 194.84,94.16 197,92 217,92 220,89
A  (via drill 0.61)
  Top 0.762: 136.75,101.75 133,105.5 133,106 IC6.11 133,106.5 133,123 132,124 132,179.5 137,184.5 137,203 136,204 134,204 131.9,201.9 131.9,200.5 IC5.11 | 136.75,101.75 137,101.5 137,97 129.9,89.9 129.9,78.4 132.5,75.8 132.5,59.5 IC7.11 | 136.75,101.75 v141.5,106.5
  Bottom 0.762: v141.5,106.5 193,106.5 194.5,108 SENSORS_JP.1
B  (via drill 0.61)
  Top 0.762: 141.75,108.25 141.5,108.5 134.5,108.5 134.5,106.5 IC6.10 | 141.75,108.25 143,107 143,101 131.6,89.6 131.6,78.9 133.8,76.7 133.8,59.5 IC7.10 | v133.1,196.5 133.1,200.1 IC5.10 | v151.6,176 151.6,175.4 151.5,118 141.75,108.25 | v201.5,109 207,114.5 207,149 204,152 202.6,152 v184.2,170.4
  Bottom 0.762: v133.1,196.5 133,194 133.5,194 v151.6,176 178.5,176 v184.2,170.4 | v201.5,109 198,109 197.5,108.5 SENSORS_JP.2
C  (via drill 0.61)
  Top 0.762: IC7.9 135,59.5 152,76.5 v152,104.5 153,105.5 v153,178 | v139,106 136,106 IC6.9 | IC5.9 134.4,200 135.8,198.6 v135.8,196
  Bottom 0.762: SENSORS_JP.3 194.5,105.5 153,105.5 v152,104.5 152,105 140,105 v139,106 | v153,178 v135.8,196
D
  Top 0.762: SENSORS_JP.4 197.5,106 199,107.5 199,109 198,110 193,110 192,109 192,107.5
  Top 0.813: 192,107.5 192,102.6 188.8,99.4 183.39,99.4 IC4.10
DATA_IN
  Top 0.61: POWER_DATA_JP.1 6.84,229.84 5,228 5,223 6,222 7.2,222 U$16.DATA_IN
E
  Top 0.762: 183.5,98 IC4.9
  Top 0.813: 183.5,98 189.5,98 194.63,103.13 SENSORS_JP.5
EN  (via drill 0.61)
  Top 0.762: 163,85 175.5,97.5 175.5,100 176.1,100.6 177.1,100.6 IC4.6 | 163,85 132.5,54.5 132.5,53.5 IC7.6 | v127.5,108.5 127.5,111 126.5,112 126.5,163.5 130,167 130,181 132,183 132,194.16 IC5.6 131.9,193.9 | v193.4,92 193.5,92 199,97.5 199,101.5 197.5,103 SENSORS_JP.6 | v153.5,92 160.5,85 163,85
  Top 0.813: IC6.6 133.16,97.84 v133.5,97.5
  Bottom 0.762: 134.25,96.75 139,92 v153.5,92 v193.4,92 | 134.25,96.75 v133.5,97.5 | v127.5,108.5 127.5,96.5 134,96.5 134.25,96.75
GND  (via drill 0.61, 0.8)
  Top 0.762: SENSORS_JP.8 197.5,100.5 197.5,98.5 SENSORS_JP.10 197,98 v192.5,93.5 | IC6.7 134.5,100.5 135.5,100.5 IC6.8 135.7,100 v135.7,98.3 | 135,53.5 134,53.5 IC7.7 133.7,52.9 v133.7,51.3 | IC4.7 177.6,99.4 177.5,98 IC4.8 177,98 177,97.5 173.25,93.75 | 135,53.5 136.5,55 136.5,57 173.25,93.75 | 135,53.5 IC7.8 | v173.5,93.5 173.25,93.75 | 197.5,131.5 200,129 v200,103.5 | IC5.8 134.5,194.5 133,194.5 IC5.7 133.1,193.7 v133.1,192.6 | 12,185.5 31.5,185.5 v32,185
  Top 1.676: 12,227 12,229 11.16,229.84 POWER_DATA_JP.3 | 12,227 12,185.5 12,180 | 12,180 12,133 | 12,133 12,86 | 12,86 12,41.4 U$6.GND_IN | U$1.GND_IN 9.9,83.9 12,86 | U$11.GND_IN 9.9,130.9 12,133 | U$21.GND_IN 9.9,177.9 12,180 | U$16.GND_IN 9.9,224.9 12,227 | v60,41 56,37 55,37 | v32,185 39,178 41,178 | v204,148 204,138 197.5,131.5 197,131
  Bottom 0.762: v135.7,98.3 140.5,93.5 v173.5,93.5 v192.5,93.5 | v200,103.5 197.5,101 SENSORS_JP.8 | v133.1,192.6 126.5,186 32.5,186 32,185.36 | v133.7,51.3 131.5,53.5 66,53.5 R55.1
  Bottom 1.676: R21.1 26.92,194.54 Q2.3 32,185.36 v32,185 | Q4.3 64.79,53.34 R55.1 60,48.55 v60,41 | Q3.3 217.97,153.06 arc90 R38.1 208.74,152.74 v204,148
  pour Top (isolate 1): 3,3 234,3 234,234 3,234
GND_OUT
  Top 1.676: U$20.GND_OUT 226.9,224.9 226,224 226,180 | 226,180 226,133 | 226,133 226,85 | 226,85 226,40.4 U$10.GND_OUT | U$25.GND_OUT 228.1,177.9 226,180 | U$15.GND_OUT 228.1,130.9 226,133 | U$5.GND_OUT 227.1,83.9 226,85
LED_VCC
  Top 1.676: POWER_DATA_JP.2 6.48,232.38 3.5,229.4 3.5,221 | 3.5,221 3.5,174 | 3.5,174 3.5,127 | 3.5,127 3.5,80 | 3.5,80 3.6,33.4 4.9,31.8 U$6.VCC_IN | U$1.VCC_IN 4.7,78.8 3.5,80 | U$11.VCC_IN 4.7,125.8 3.5,127 | U$21.VCC_IN 4.7,172.8 3.5,174 | U$16.VCC_IN 4.7,219.8 3.5,221
N$1
  Top 1.676: U$1.VCC_OUT U$2.VCC_IN
N$2
  Top 1.676: U$1.DATA_OUT U$2.DATA_IN
N$3
  Top 1.676: U$2.GND_IN U$1.GND_OUT
N$4
  Top 1.676: U$3.VCC_IN U$2.VCC_OUT
N$5
  Top 1.676: U$3.DATA_IN U$2.DATA_OUT
N$6
  Top 1.676: U$2.GND_OUT U$3.GND_IN
N$7
  Top 1.676: U$4.VCC_IN U$3.VCC_OUT
N$8
  Top 1.676: U$4.DATA_IN U$3.DATA_OUT
N$9
  Top 1.676: U$4.GND_IN U$3.GND_OUT
N$10
  Top 1.676: U$4.VCC_OUT U$5.VCC_IN
N$11
  Bottom 1.676: OS4.A 26.89,211.08 R6.1
N$12  (via drill 0.61)
  Top 0.813: IC5.13 129.31,202.19 v129,202.5
  Bottom 0.762: v129,202.5 128,203.5 20.5,203.5 20,204 20,207.5 21.5,207.5 R5.1
  Bottom 1.676: OS4.C 21.89,211.16 R5.1
N$13  (via drill 0.61)
  Top 0.762: v128,198.5 128,200 IC5.14 | v78,202 69,211 OS2.C
  Bottom 0.762: v128,198.5 124.5,202 v78,202
  Bottom 1.676: OS2.C 68.89,211.16 R7.1
N$14
  Top 0.762: IC5.15 126.8,200.5 126.8,204.7 122,209.5 117.5,209.5 116,211 OS3.C
  Bottom 1.676: OS3.C 115.89,211.15 R9.1
N$15
  Bottom 1.676: OS2.A 73.89,211.08 R8.1
N$16
  Top 0.762: 208.5,212.5 209.5,211.5 OS6.C | IC5.1 125.5,194.5 111,209 111,213 114.5,216.5 204.5,216.5 205.5,215.5
  Top 0.813: 205.5,215.5 208.5,212.5
  Bottom 1.676: OS6.C 210,211.19 R13.1
N$17  (via drill 0.61)
  Top 0.762: v129.5,160.5 129.5,121 130.6,119.9 130.6,106.5 IC6.13
  Bottom 0.762: v129.5,160.5 130,161 162.5,161 R22.1
  Bottom 1.676: OS10.C 162.98,161.48 R22.1
N$18
  Bottom 1.676: OS3.A 120.89,211.07 R10.1
N$19
  Bottom 1.676: OS10.A 168.06,161.6 R23.1
N$20
  Top 0.762: IC5.12 130.6,200.6 130.6,202.1 139.5,211 162.5,211 OS5.C
  Bottom 1.676: OS5.C 162.89,211.16 R11.1
N$21
  Bottom 1.676: OS5.A 168,211.19 R12.1
N$22  (via drill 0.61)
  Top 0.762: v128,123 128,120.5 129.4,119.1 129.4,106.6 IC6.14 | v202,156.5 209.5,164 OS11.C
  Bottom 0.762: v128,123 161.7,156.5 v202,156.5
  Bottom 1.676: OS11.C 209.96,161.66 R24.1
N$23
  Bottom 1.676: OS11.A 215.04,161.74 R25.1
N$24
  Bottom 1.676: OS6.A 215,211.19 R14.1
N$25
  Bottom 1.676: R27.1 27,117.21 OS12.A
N$26
  Top 0.762: 130.5,194 IC5.5 130.59,184.59 128,182 128,168 122.5,162.5 23,162.5 22,164 OS7.C
  Bottom 1.676: R15.1 22,164.19 OS7.C
N$27
  Bottom 1.676: R16.1 27,164.19 OS7.A
N$28  (via drill 0.61)
  Top 0.762: v131,121.5 131.9,120.5 131.9,106.5 IC6.12 | v73,121.5 69,117.5 OS13.C
  Bottom 0.762: v73,121.5 v131,121.5
  Bottom 1.676: OS13.C 68.94,114 R28.1
N$29
  Top 0.762: IC5.2 126.78,192.78 104,170 67,170 65,168 65,165.8 66.6,164.2 68.93,164.2 OS8.C
  Bottom 1.676: R17.1 69,164.19 OS8.C
N$30
  Bottom 1.676: R18.1 74,164.19 OS8.A
N$31
  Bottom 1.676: OS6.K OS6.E OS5.K OS5.E OS3.K OS3.E OS2.K OS2.E OS4.K OS4.E 20.27,213.77 16.5,210 16.5,196.97 Q2.4 16.5,196.73 16.5,172.23 OS7.E OS7.K OS8.E OS8.K OS9.E OS9.K
N$32
  Top 0.762: 129.3,194 IC5.4 129.31,187.31 119,177 119,166 118,165 116.5,165 116,164.5 OS9.C
  Bottom 1.676: R19.1 116,164.18 OS9.C
N$33
  Bottom 1.676: OS9.A 121.03,161.33 R20.1
N$34
  Bottom 1.676: OS13.A 74.02,114.04 R29.1
N$35
  Top 1.676: U$5.DATA_IN U$4.DATA_OUT
N$36
  Bottom 1.676: OS14.A 121.04,114.22 arc-90 R31.1
N$37  (via drill 0.61)
  Top 0.762: v132,104.5 132,100.5 IC6.5 | v154.5,109 162.5,117 OS15.C
  Bottom 0.762: v132,104.5 136.5,109 v154.5,109
  Bottom 1.676: OS15.C 163,117.19 R32.1
N$38
  Bottom 1.676: OS15.A 168,117.19 R33.1
N$39  (via drill 0.61)
  Top 0.762: v126,96.5 128.1,98.5 128.1,100 IC6.2 | v194,90.5 209.5,106 209.5,117 OS16.C
  Bottom 0.762: v126,96.5 132,90.5 v194,90.5
  Bottom 1.676: OS16.C 210,117.19 R34.1
N$40
  Bottom 1.676: OS16.A 215,117.19 R35.1
N$41
  Bottom 1.676: OS10.E OS10.K OS11.E OS11.K 223.33,166.77 228.5,161.6 228.5,150.87 Q3.4 228.38,123.38 225,120 215.27,120 OS16.K OS16.E OS15.K OS15.E OS14.K OS14.E 115.91,119.82 OS13.K OS13.E 27.07,119.82 OS12.K OS12.E 20.77,119.77 16,115 16,78.8 22.03,72.77 OS17.K OS17.E
N$42
  Top 0.762: IC6.4 130.5,100 130.5,99 97.5,66 25,66 22,69 22,70.5 OS17.C
  Bottom 1.676: OS17.C 21.96,67.62 R36.1
N$43
  Bottom 1.676: OS17.A 27.04,68.05 R37.1
N$44
  Top 1.676: U$4.GND_OUT U$5.GND_IN
N$45
  Top 0.762: 127.5,104.5 128,105 128,106 IC6.15 | OS12.C 22,117 23,115.5 77,115.6 79.7,118.5 84.2,123 121,123 124,120 124,111
  Top 0.813: 124,111 124,105.7 125.2,104.5 127.5,104.5
  Bottom 1.676: OS12.C 21.94,113.84 R26.1
N$46
  Top 0.762: IC6.1 126.5,100.5 116,111 116,117 OS14.C
  Bottom 1.676: OS14.C 115.96,114.14 arc90 R30.1
N$47  (via drill 0.61)
  Top 0.762: v130,57.5 130,59 IC7.13
  Bottom 0.762: v130,57.5 127,60.5 67.5,60.5 66,62 66,65.5 67,66.5 68,66.5 R39.1
  Bottom 1.676: OS18.C 68.96,67.13 arc-90 R39.1
N$48
  Bottom 1.676: OS18.A 74.04,67.29 arc-90 R40.1
N$49  (via drill 0.61)
  Top 0.762: v128.7,61.4 128.7,59.5 IC7.14 | v123,62 116,69 116,70 OS19.C
  Bottom 0.762: v128.7,61.4 128,62 v123,62
  Bottom 1.676: OS19.C 115.92,67.25 arc-90 R41.1
N$50
  Bottom 1.676: OS19.A 121,67.41 arc-90 R42.1
N$51
  Bottom 1.676: OS20.A 168.03,67.6 R44.1
N$52  (via drill 0.61)
  Top 0.762: v131.2,61.6 131.2,59.5 IC7.12 | v202,62.5 209.5,70 OS21.C
  Bottom 0.762: v131.2,61.6 132,62.5 v202,62.5
  Bottom 1.676: OS21.C 209.98,67.63 R45.1
N$53
  Bottom 1.676: OS21.A 215.06,67.79 R46.1
N$54
  Bottom 1.676: OS22.A 27.04,20.93 R48.1
N$55  (via drill 0.61, 0.8)
  Top 0.762: v131.2,51.3 131.2,52.8 IC7.5 | 69,23.5 OS23.C 68.92,23.2 63.7,23.2 63,23.9 63,27 64.3,28.3 v65.5,28.3
  Bottom 0.762: v131.2,51.3 108.1,28.3 v65.5,28.3
  Bottom 1.676: R49.1 68.65,22.89 OS23.C
N$56
  Bottom 1.676: OS23.A 74.02,21.07 R50.1
N$57
  Top 0.762: IC7.2 127.5,53 127.5,35 116,23.5 OS24.C
  Bottom 1.676: R51.1 115.65,22.94 OS24.C
N$58
  Bottom 1.676: OS24.A 121.02,20.23 R52.1
N$59
  Top 1.676: U$7.VCC_IN U$6.VCC_OUT
N$60
  Top 0.762: IC7.4 130,53 130,33.5 140.5,23 162.5,23 OS25.C
  Bottom 1.676: OS25.C 162.97,20.26 R53.1
N$61
  Bottom 1.676: OS25.A R54.1
N$62
  Top 1.676: U$6.DATA_OUT U$7.DATA_IN
N$63  (via drill 0.61)
  Top 0.762: v131,66 127.5,62.5 127.5,59.5 IC7.15
  Bottom 0.762: v131,66 132,67 162,67 R43.1
  Bottom 1.676: OS20.C R43.1
N$64
  Top 0.762: 126,53 IC7.1 126,53.2 126,50 97.5,21.5 23.5,21.5 22,23 OS22.C
  Bottom 1.676: R47.1 21.95,23.02 OS22.C
N$65
  Top 1.676: U$7.GND_IN U$6.GND_OUT
N$66
  Top 1.676: U$8.VCC_IN U$7.VCC_OUT
N$67
  Top 1.676: U$8.DATA_IN U$7.DATA_OUT
N$68
  Top 1.676: U$7.GND_OUT U$8.GND_IN
N$69
  Top 0.762: IC4.12 183,102 180.3,102 180.3,107.7 178,110 178,198.5 164,212.5 113.9,212.5 113,211.6 113,210.5 114.5,209 128.1,195.5 128.1,194.5 IC5.3
N$70  (via drill 0.61)
  Top 0.762: v129.5,102.5 129.5,100.5 IC6.3 | v181.5,103.5 182.4,104.4 183,104.4 IC4.14
  Bottom 0.762: v129.5,102.5 130,103 181,103 v181.5,103.5
N$71  (via drill 0.61)
  Top 0.762: v131.8,97.8 124.5,90.5 124.5,58.5 128.7,54.5 128.7,53.5 IC7.3 | v185.5,104 185.5,105.1 185,105.7 183.7,105.7 IC4.15
  Bottom 0.762: v131.8,97.8 136,102 183.5,102 v185.5,104
N$72
  Top 0.762: OS26.C 210,23.5 207.5,23.5 205,26 205,35 178,62 178,86 180.2,88.2 180.2,99.5 181.34,100.64 IC4.11
  Bottom 1.676: R56.1 209.65,22.88 OS26.C
N$73
  Bottom 1.676: OS21.K OS21.E OS20.K OS20.E OS19.K OS19.E 115.87,72.77 OS18.K OS18.E 62.77,72.77 55,65 55,56.03 Q4.4 54.62,50.62 52,48 23,48 19,44 19,28.73 OS22.E OS22.K 27.09,25.72 OS23.E OS23.K 74.07,25.77 OS24.E OS24.K OS25.E OS25.K OS26.E OS26.K
N$74
  Top 1.676: U$9.VCC_IN U$8.VCC_OUT
N$75
  Bottom 1.676: R57.1 214.65,22.8 OS26.A
N$76
  Top 1.676: U$8.DATA_OUT U$9.DATA_IN
N$77
  Top 1.676: U$9.GND_IN U$8.GND_OUT
N$78
  Top 1.676: U$9.VCC_OUT U$10.VCC_IN
N$79
  Top 1.676: U$10.DATA_IN U$9.DATA_OUT
N$80
  Top 1.676: U$9.GND_OUT U$10.GND_IN
N$81
  Top 1.676: U$11.VCC_OUT U$12.VCC_IN
N$82
  Top 1.676: U$11.DATA_OUT U$12.DATA_IN
N$83
  Top 1.676: U$12.GND_IN U$11.GND_OUT
N$84
  Top 1.676: U$13.VCC_IN U$12.VCC_OUT
N$85
  Top 1.676: U$12.DATA_OUT U$13.DATA_IN
N$86
  Top 1.676: U$12.GND_OUT U$13.GND_IN
N$87
  Top 1.676: U$14.VCC_IN U$13.VCC_OUT
N$88
  Top 1.676: U$14.DATA_IN U$13.DATA_OUT
N$89
  Top 1.676: U$14.GND_IN U$13.GND_OUT
N$90
  Top 1.676: U$15.VCC_IN U$14.VCC_OUT
N$91
  Top 1.676: U$14.DATA_OUT U$15.DATA_IN
N$92
  Top 1.676: U$15.GND_IN U$14.GND_OUT
N$93
  Top 1.676: U$16.VCC_OUT U$17.VCC_IN
N$94
  Top 1.676: U$16.DATA_OUT U$17.DATA_IN
N$95
  Top 1.676: U$16.GND_OUT 54,224.9 54,225 54.5,225 U$17.GND_IN
N$96
  Top 1.676: U$17.VCC_OUT U$18.VCC_IN
N$97
  Top 1.676: U$17.DATA_OUT U$18.DATA_IN
N$98
  Top 1.676: U$17.GND_OUT U$18.GND_IN
N$99
  Top 1.676: U$18.VCC_OUT U$19.VCC_IN
N$100
  Top 1.676: U$19.DATA_IN U$18.DATA_OUT
N$101
  Top 1.676: U$18.GND_OUT U$19.GND_IN
N$102
  Top 1.676: U$20.VCC_IN U$19.VCC_OUT
N$103
  Top 1.676: U$19.DATA_OUT U$20.DATA_IN
N$104
  Top 1.676: U$19.GND_OUT U$20.GND_IN
N$105
  Top 1.676: U$21.VCC_OUT U$22.VCC_IN
N$106
  Top 1.676: U$21.DATA_OUT U$22.DATA_IN
N$107
  Top 1.676: U$21.GND_OUT U$22.GND_IN
N$108
  Top 1.676: U$22.VCC_OUT U$23.VCC_IN
N$109
  Top 1.676: U$22.DATA_OUT U$23.DATA_IN
N$110
  Top 1.676: U$22.GND_OUT U$23.GND_IN
N$111
  Top 1.676: U$23.VCC_OUT U$24.VCC_IN
N$112
  Top 1.676: U$23.DATA_OUT U$24.DATA_IN
N$113
  Top 1.676: U$23.GND_OUT U$24.GND_IN
N$114
  Top 1.676: U$24.VCC_OUT U$25.VCC_IN
N$115
  Top 1.676: U$25.DATA_IN U$24.DATA_OUT
N$116
  Top 1.676: U$25.GND_IN U$24.GND_OUT
N$117
  pour Bottom (isolate 1): 3,3 234,3 234,234 3,234
N$118
  Top 0.406: 38,225 199,225
N$119
  Top 0.406: 56,178 58,178
N$120
  Top 0.406: 85,178 106,178
N$121
  Top 0.406: 197,178 199,178
N$122
  Top 0.406: 106,131 38,131 38,130
N$123
  Top 0.406: 37,84 106,84
N$124
  Top 0.406: 197,84 199,84
N$125
  Top 0.406: 181,37 179,37
N$126
  Top 0.406: 199,37 197,37
N$127
  Top 0.406: 152,37 150,37
N$128
  Top 0.406: 134,37 132,37
N$129
  Top 0.406: 105,37 102,37
N$130
  Top 0.406: 85,37 87,37
SECTION_1_EN  (via drill 0.61)
  Top 0.762: v138.8,198.5 176,161.6 176,108 177,107 IC4.1
  Bottom 0.762: v138.8,198.5 130,198.5 128.5,197 27.5,197 R21.2
  Bottom 1.676: Q2.1 25.3,199.16 R21.2
SECTION_2_EN  (via drill 0.61)
  Top 0.762: IC4.5 177,102 172,102 171,103 171,119.5 v173,121.5
  Bottom 0.762: v173,121.5 198,146.5 214,146.5 217,149.5 R38.2
  Bottom 1.676: Q3.1 219.11,148.44 R38.2
SECTION_3_EN  (via drill 0.61)
  Top 0.762: 179,103.2 177.5,103.2 IC4.4 | 179,103.2 179,105.7 177.7,105.7 IC4.2 | 179,103.2 179,97 v138,56
  Bottom 0.762: v138,56 65.5,56 R55.2
  Bottom 1.676: Q4.1 64.13,57.96 R55.2
SENSOR  (via drill 0.61)
  Top 0.762: v186.5,101 184.3,103.2 183.6,103.2 IC4.13
  Bottom 0.762: v186.5,101 194.5,101 SENSORS_JP.7
VCC_OUT
  Top 1.676: U$20.VCC_OUT 233,216.3 233,174 | 233,174 233,127 | 233,127 233,80 | 233,80 233,33 232,32 229.7,32 U$10.VCC_OUT | U$5.VCC_OUT 231.8,78.8 233,80 | U$15.VCC_OUT 231.8,125.8 233,127 | U$25.VCC_OUT 231.8,172.8 233,174